# EAGLE design arduino uno board (EAGLE 9.4.2)
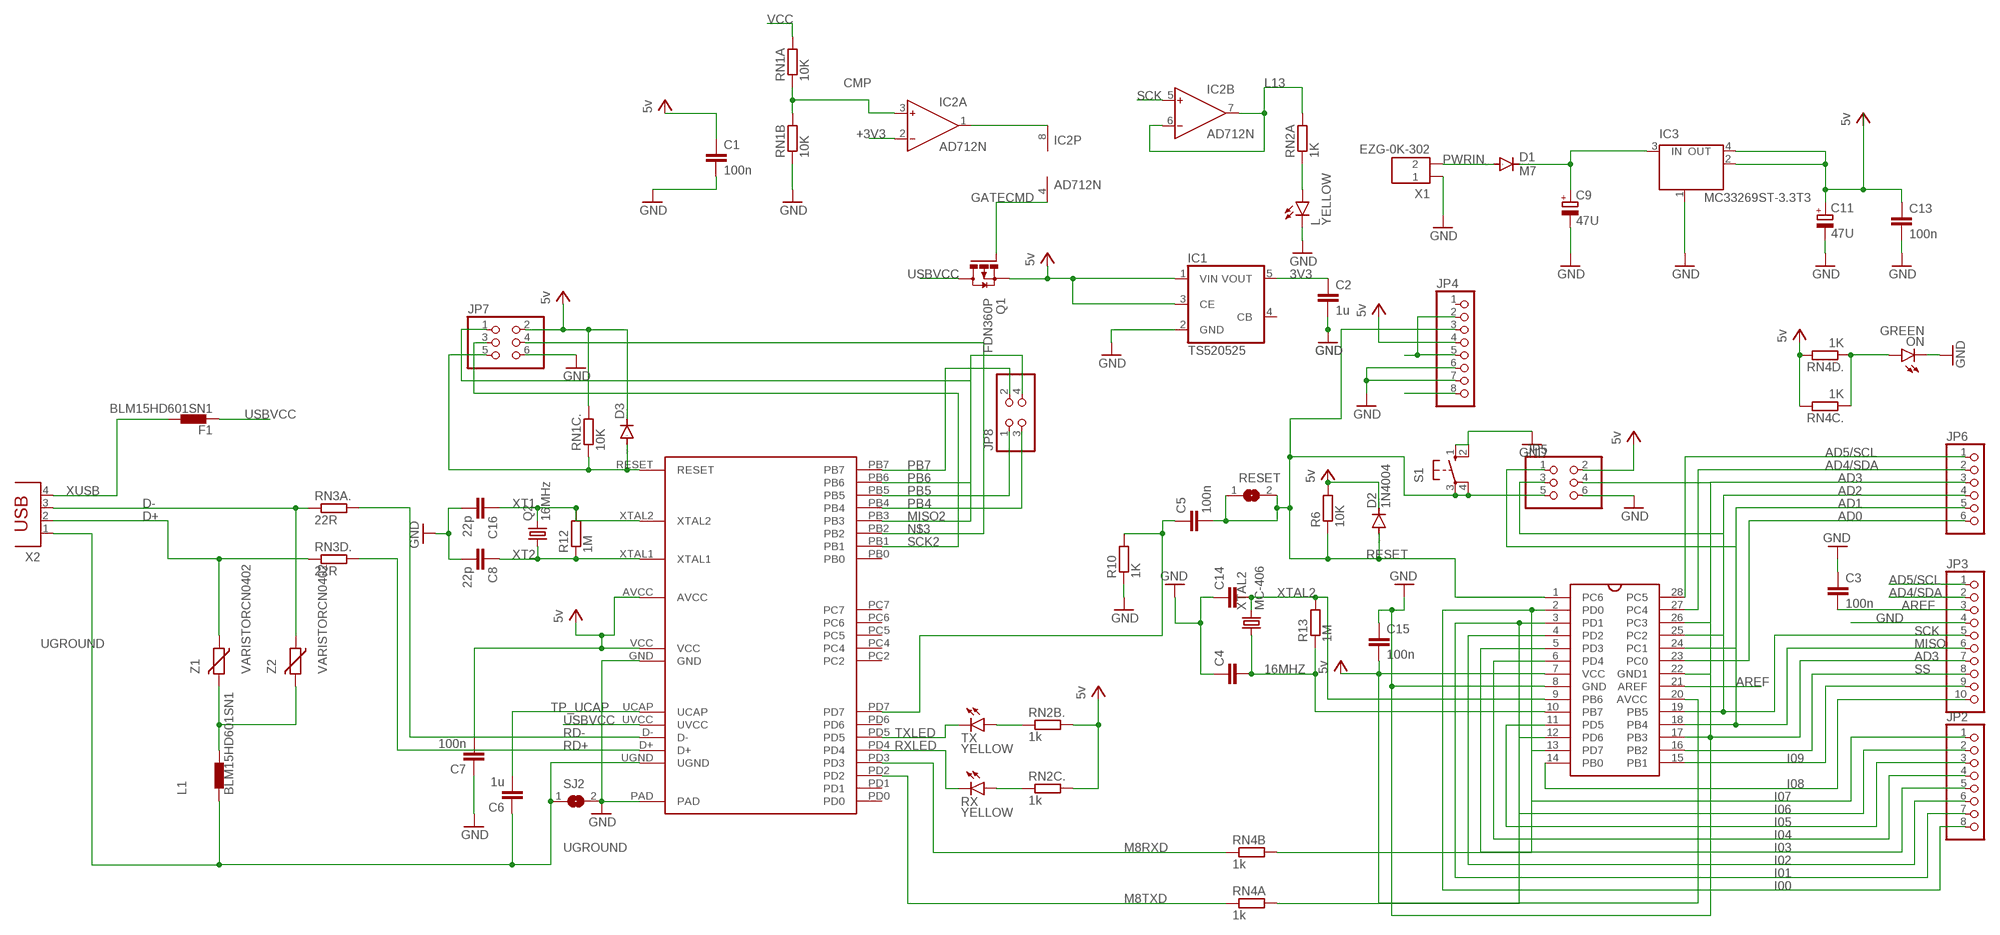
[diagram p0: schematic, sheet 1]

## Parts
C1  100n  C-EUC0603  [C0603]
C2  1u  C-EUC0603  [C0603]
C3  100n  C-EUC0603  [C0603]
C4  C-EUC0603  [C0603]
C5  100n  C-EUC0603  [C0603]
C6  1u  C-EUC0603  [C0603]
C7  100n  C-EUC0603  [C0603]
C8  22p  C-EUC0603  [C0603]
C9  47U  CPOL-EUR/2012-12W  [R/2012-12W]
C11  47U  CPOL-EUR/2012-12W  [R/2012-12W]
C13  100n  C-EUC0603  [C0603]
C14  C-EUC0603  [C0603]
C15  100n  C-EUC0603  [C0603]
C16  22p  C-EUC0603  [C0603]
D1  M7  DIODE-MICROMELF-R  [MICROMELF-R]
D2  1N4004  DIODE-MICROMELF-R  [MICROMELF-R]
D3  DIODE-MICROMELF-R  [MICROMELF-R]
F1  BLM15HD601SN1  [0402]
IC1  TS520525  [SOT25]
IC2  AD712N  [DIL08]
IC3  MC33269ST-3.3T3  [SOT223]
JP2  PINHD-1X8  [1X08]
JP3  PINHD-1X10  [1X10]
JP4  PINHD-1X8  [1X08]
JP5  PINHD-2X3  [2X03]
JP6  PINHD-1X6  [1X06]
JP7  PINHD-2X3  [2X03]
JP8  PINHD-2X2  [2X02]
L  YELLOW  LEDCHIPLED-0603-TTW  [CHIPLED-0603-TTW]
L1  BLM15HD601SN1  [0402]
ON  GREEN  LEDCHIPLED-0603-TTW  [CHIPLED-0603-TTW]
Q1  FDN360P  [SUPER-SOT3]
Q2  16MHz  CRYSTALCTS406  [CTS406]
R6  10K  R-EU_R0201  [R0201]
R10  1K  R-EU_R0201  [R0201]
R12  1M  R-EU_R0201  [R0201]
R13  1M  R-EU_R0201  [R0201]
RESET  SJ  [SJ]
RN1A  10K  R-EU_R0201  [R0201]
RN1B  10K  R-EU_R0201  [R0201]
RN1C.  10K  R-EU_R0201  [R0201]
RN2A  1K  R-EU_R0201  [R0201]
RN2B.  1k  R-EU_R0201  [R0201]
RN2C.  1k  R-EU_R0201  [R0201]
RN3A.  22R  R-EU_R0201  [R0201]
RN3D.  22R  R-EU_R0201  [R0201]
RN4A  1k  R-EU_R0201  [R0201]
RN4B  1k  R-EU_R0201  [R0201]
RN4C.  1K  R-EU_R0201  [R0201]
RN4D.  1K  R-EU_R0201  [R0201]
RX  YELLOW  LEDCHIPLED-0603-TTW  [CHIPLED-0603-TTW]
S1  10-XX  [B3F-10XX]
SJ2  SJ  [SJ]
TX  YELLOW  LEDCHIPLED-0603-TTW  [CHIPLED-0603-TTW]
U$1  ARDUINOUNO  [ARDUINOUNO]
U$2  ATMEGA16U2  [ATMEGA16U2]
X1  EZG-0K-302  [EZG-0B-0K-302]
X2  PN61729  [PN61729]
XTAL2  MC-406  [MC-406]
Z1  VARISTORCN0402  [CT/CN0402]
Z2  VARISTORCN0402  [CT/CN0402]

## Nets
3V3: C2.1 IC1.5(VOUT)
16MHZ: C4.2 R13.1 U$1.10(PB7) XTAL2.1
+3V3: IC2.2(A:IN-)
AD0: JP6.6 U$1.23(PC0)
AD1: JP6.5 U$1.24(PC1)
AD2: JP6.4 U$1.25(PC2)
AD3: JP3.7 JP5.4 JP6.3 U$1.17(PB3) U$1.26(PC3)
AD4/SDA: JP3.2 JP6.2 U$1.27(PC4)
AD5/SCL: JP3.1 JP6.1 U$1.28(PC5)
AREF: C3.2 JP3.3 U$1.21(AREF)
CMP: IC2.3(A:IN+) RN1A.1 RN1B.2
D+: RN3D..1 X2.2 Z1.1
D-: RN3A..1 X2.3 Z2.1
GATECMD: IC2.4(P:V-) Q1.1(G)
GND: C1.2 C2.2 C3.1 C4.1 C7.1 C8.2 C9.- C11.- C13.2 C14.1 C15.1 C16.2 IC1.2(GND) IC3.1(GND/ADJ) JP3.4 JP4.6 JP4.7 JP5.6 JP7.6 L.C@1(C) ON.C@1(C) R10.1 RN1B.1 S1.1(S) S1.2(S1) SJ2.2 U$1.8(GND) U$1.22(GND1) U$2.GND U$2.PAD X1.1
I00: JP2.8 RN4B.2 U$1.2(PD0)
I01: JP2.7 RN4A.2 U$1.3(PD1)
I02: JP2.6 U$1.4(PD2)
I03: JP2.5 U$1.5(PD3)
I04: JP2.4 U$1.6(PD4)
I05: JP2.3 U$1.11(PD5)
I06: JP2.2 U$1.12(PD6)
I07: JP2.1 U$1.13(PD7)
I08: JP3.10 U$1.14(PB0)
I09: JP3.9 U$1.15(PB1)
L13: IC2.6(B:IN-) IC2.7(B:OUT) RN2A.2
M8RXD: RN4B.1 U$2.PD3
M8TXD: RN4A.1 U$2.PD2
MISO: JP3.6 JP5.1 U$1.18(PB4)
MISO2: JP7.1 U$2.PB3
N$1: RN2B..1 TX.A@1(A)
N$2: RN2C..1 RX.A@1(A)
N$3: JP7.4 U$2.PB2
N$4: IC2.1(A:OUT) IC2.8(P:V+)
N$6: C9.+ D1.C IC3.3(IN)
N$8: L.A@1(A) RN2A.1
N$9: ON.A@1(A) RN4C..1 RN4D..1
N$37: C5.1 R10.2 U$2.PD7
N$38: JP4.8
N$40: JP4.2 JP4.5
N$56: D3.A JP7.5 RN1C..1 U$2.RESET
N$64: L1.2 Z1.2 Z2.2
PB4: JP8.3 U$2.PB4
PB5: JP8.1 U$2.PB5
PB6: JP8.4 U$2.PB6
PB7: JP8.2 U$2.PB7
PWRIN: D1.A X1.2
RD+: RN3D..2 U$2.D+
RD-: RN3A..2 U$2.D-
RESET: C5.2 D2.A JP4.3 JP5.5 R6.1 RESET.1 RESET.2 S1.3(P) S1.4(P1) U$1.1(PC6)
RXLED: RX.C@1(C) U$2.PD4
SCK: IC2.5(B:IN+) JP3.5 JP5.3 U$1.19(PB5)
SCK2: JP7.3 U$2.PB1
SS: JP3.8 U$1.16(PB2)
TP_UCAP: C6.2 U$2.UCAP
TXLED: TX.C@1(C) U$2.PD5
UGROUND: C6.1 L1.1 SJ2.1 U$2.UGND X2.1
USBVCC: F1.1 Q1.3(D) U$2.UVCC
VCC: C1.1 C7.2 C11.+ C13.1 C15.2 D2.C D3.C IC1.1(VIN) IC1.3(CE) IC3.2(OUT) IC3.4(OUT) JP4.4 JP5.2 JP7.2 Q1.2(S) R6.2 RN1A.2 RN1C..2 RN2B..2 RN2C..2 RN4C..2 RN4D..2 U$1.7(VCC) U$1.20(AVCC) U$2.AVCC U$2.VCC ; supply symbol labelled 5v
XT1: C16.1 Q2.3 R12.2 U$2.XTAL2
XT2: C8.1 Q2.1 R12.1 U$2.XTAL1
XTAL2: C14.2 R13.2 U$1.9(PB6) XTAL2.4
XUSB: F1.2 X2.4
Unconnected: IC1.4(CB) JP4.1 U$2.PB0 U$2.PC2 U$2.PC4 U$2.PC5 U$2.PC6 U$2.PC7 U$2.PD0 U$2.PD1 U$2.PD6

## Library data of the parts
C1-C8 C13-C16 = rcl:C-EU: CAPACITOR, European symbol; SPICEPREFIX: C
C9 C11 = rcl:CPOL-EU: POLARIZED CAPACITOR, European symbol; SPICEPREFIX: C
D1-D3 = diode:DIODE-: DIODE
F1 L1 = inductors:BLM15H: EMIFIL (R) Chip Ferrite Bead for GHz Noise Source: http://www.murata.com/ Ferrite Bead BLM15H.pdf
IC1 = v-reg:TS5205: 150mA Low Noise LDO Voltage Regulator with Enable TSC [Taiwan Semiconductor Company, Ltd] Source: http://www.taiwansemi.com .. 5205_0409c.pdf
IC2 = analog-devices:AD712: Dual Precision, Low Cost, High Speed BiFET Op Amp Source: http://www.analog.com/static/imported-files/data_sheets/AD712.pdf; MF: ALTERA CORPORATION; MPN: AD712JNZ; OC_FARNELL: 9604898; OC_NEWARK: 59K4554
IC3 = linear:MC33269ST*: Adjustable Output Low Dropout Voltage Regulator 800 mA Source: http://www.onsemi.com/pub/Collateral/MC33269-D.PDF
JP2 JP4 = pinhead:PINHD-1X8: PIN HEADER
JP3 = pinhead:PINHD-1X10: PIN HEADER
JP5 JP7 = pinhead:PINHD-2X3: PIN HEADER
JP6 = pinhead:PINHD-1X6: PIN HEADER
JP8 = pinhead:PINHD-2X2: PIN HEADER
L ON RX TX = led:LED: LED OSRAM: - CHIPLED LG R971, LG N971, LY N971, LG Q971, LY Q971, LO R971, LY R971 LH N974, LH R974 LS Q976, LO Q976, LY Q976 LO Q996 - Hyper CHIPLED LW Q18S LB Q993, LB Q99A, LB R99A - SideLED LS A670, LO A670, LY A670, LG A670, LP A670 LB A673, LV A673, LT A673, LW A673 LH A674 LY A675 LS A676, LA A676, LO A676, LY A676, LW A676 LS A679, LY A679, LG A679 - Hyper Micro SIDELED® LS Y876, LA Y876, LO Y876, LY Y876 LT Y87S - SmartLED LW L88C, LW L88S LB L89C, LB L89S, LG L890 LS L89K, LO L89K, LY L89K LS L896, LA L896, LO L896, LY L896 - TOPLED LS T670, LO T670, LY T670, LG T670, LP T670 LSG T670, LSP T670, LSY T670, LOP T670, LYG T670 LG T671, LOG T671, LSG T671 LB T673, LV T673, LT T673, LW T673 LH T674 LS T676, LA T676, LO T676, LY T676, LB T676, LH T676, LSB T676, LW T676 LB T67C, LV T67C, LT T67C, LS T67K, LO T67K, LY T67K, LW E67C LS E67B, LA E67B, LO E67B, LY E67B, LB E67C, LV E67C, LT E67C LW T67C LS T679, LY T679, LG T679 LS T770, LO T770, LY T770, LG T770, LP T770 LB T773, LV T773, LT T773, LW T773 LH T774 LS E675, LA E675, LY E675, LS T675 LS T776, LA T776, LO T776, LY T776, LB T776 LHGB T686 LT T68C, LB T68C - Hyper Mini TOPLED® LB M676 - Mini TOPLED Santana® LG M470 LS M47K, LO M47K, LY M47K Source: http://www.osram.convergy.de LUXEON: - LUMILED® LXK2-PW12-R00, LXK2-PW12-S00, LXK2-PW14-U00, LXK2-PW14-V00 LXK2-PM12-R00, LXK2-PM12-S00, LXK2-PM14-U00 LXK2-PE12-Q00, LXK2-PE12-R00, LXK2-PE12-S00, LXK2-PE14-T00, LXK2-PE14-U00 LXK2-PB12-K00, LXK2-PB12-L00, LXK2-PB12-M00, LXK2-PB14-N00, LXK2-PB14-P00, LXK2-PB14-Q00 LXK2-PR12-L00, LXK2-PR12-M00, LXK2-PR14-Q00, LXK2-PR14-R00 LXK2-PD12-Q00, LXK2-PD12-R00, LXK2-PD12-S00 LXK2-PH12-R00, LXK2-PH12-S00 LXK2-PL12-P00, LXK2-PL12-Q00, LXK2-PL12-R00 Source: www.luxeon.com KINGBRIGHT: KA-3528ASYC Source: www.kingbright.com
Q1 = transistor-power:FDN360P: Single P-Channel, PowerTrench (R) MOSFET Source: http://www.fairchildsemi.com/ds/FD/FDN360P.pdf
Q2 = crystal:CRYSTAL: CRYSTAL; OC_FARNELL: unknown; OC_NEWARK: unknown
R6 R10 R12 R13 RN1A RN1B RN1C. RN2A RN2B. RN2C. RN3A. RN3D. RN4A RN4B RN4C. RN4D. = rcl:R-EU_: RESISTOR, European symbol; SPICEPREFIX: R
RESET SJ2 = jumper:SJ: SMD solder JUMPER
S1 = switch-omron:10-XX: OMRON SWITCH; MPN: B3F-1000; OC_FARNELL: 176432; OC_NEWARK: 36M3542
U$1 = arduino uno:ARDUINOUNO
U$2 = arduino uno:ATMEGA16U2
X1 = con-lemo:EZG-?-302: LEMO Connector Source: http://www.lemo.com/pdfs/catalog/ROW/German/unipole_multipole.pdf; OC_FARNELL: unknown; OC_NEWARK: unknown
X2 = con-berg:PN61729: BERG USB connector; OC_FARNELL: unknown; OC_NEWARK: unknown
XTAL2 = crystal:MC-406: kHz RANGE CRYSTAL UNIT SMD Source: MC-306_405_406_E07X.PDF Homepage <http://www.epsontoyocom.co.jp>; MF: BANNER ENGINEERING CORPORATION; MPN: MQDMC-406; OC_FARNELL: 1216226; OC_NEWARK: 21H2317
Z1 Z2 = varistor:VARISTOR: VARISTOR

## Board
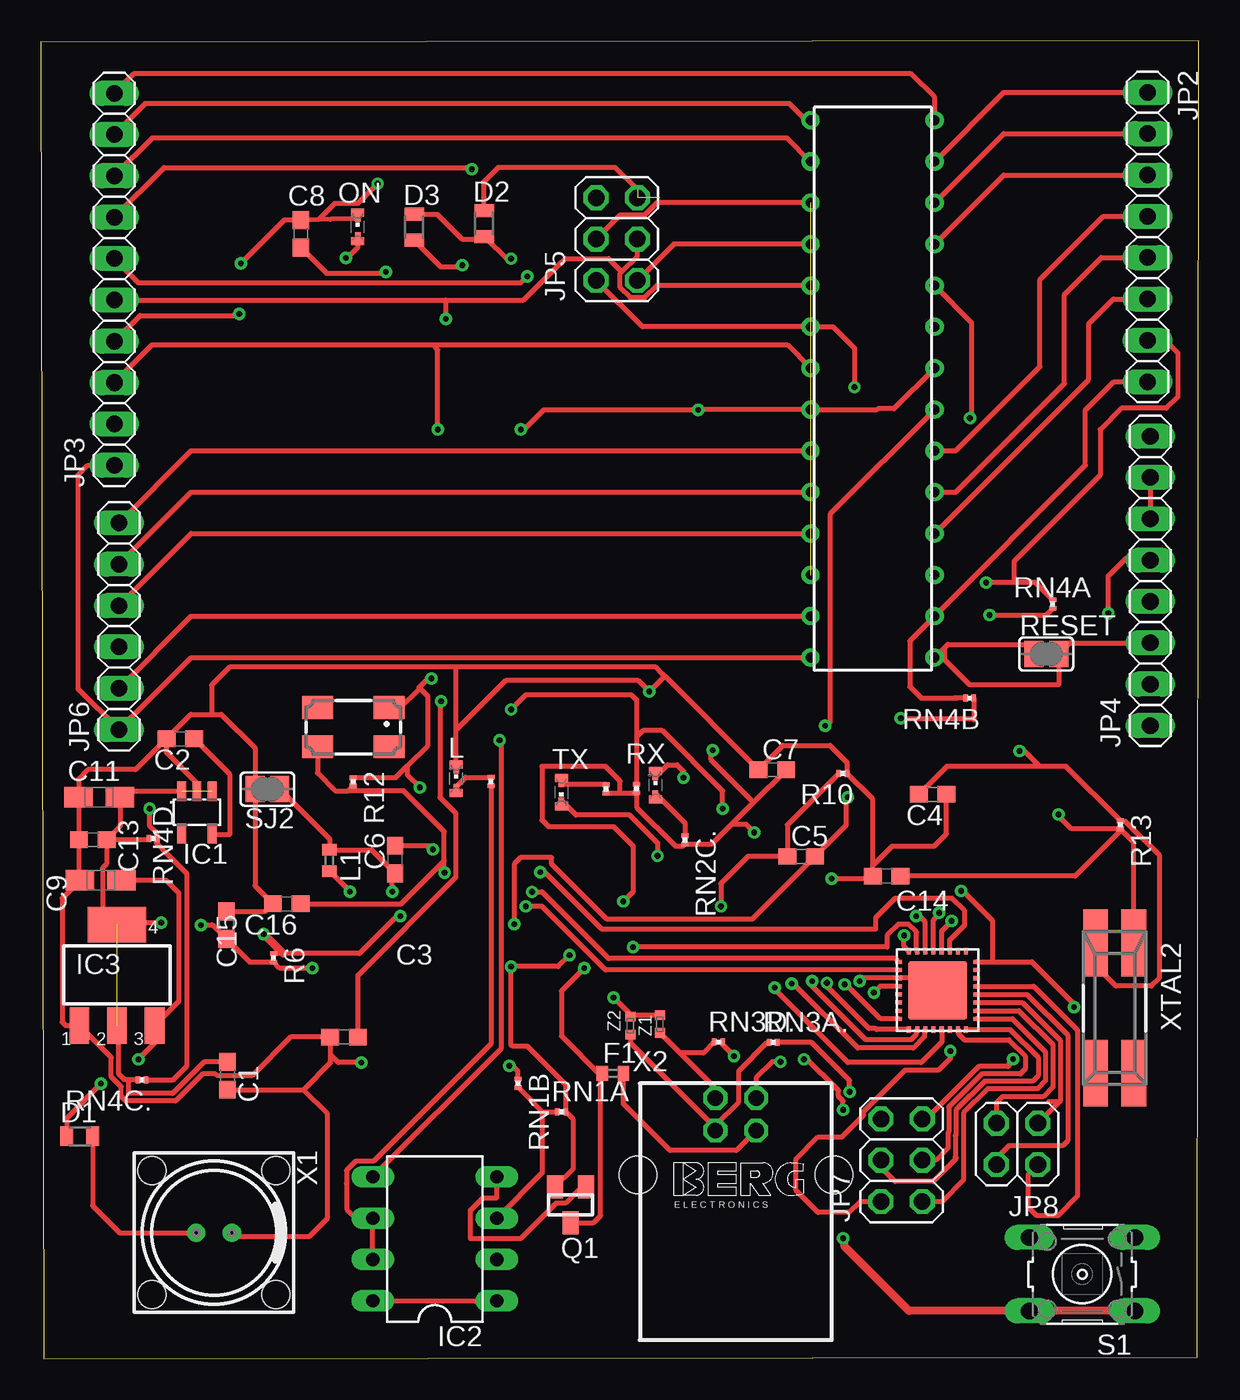
[diagram p1: board, top side]
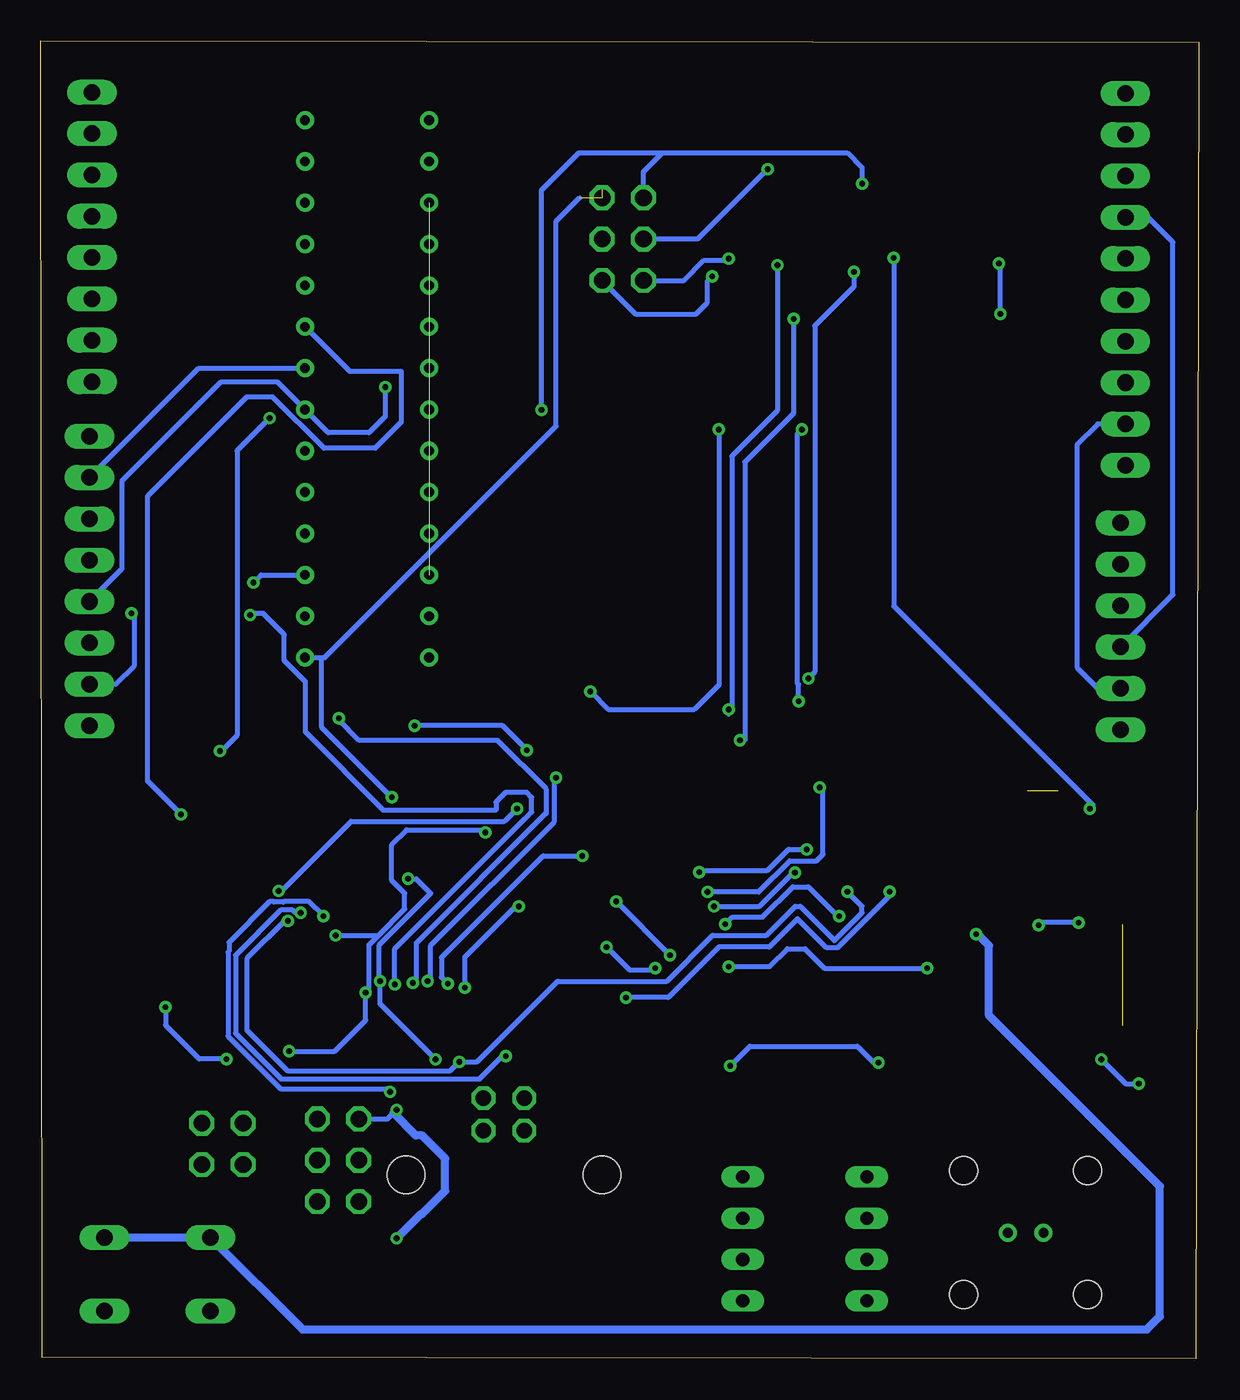
[diagram p2: board, bottom side, seen from below]

Size 71.17 x 80.99 mm. Coordinates in mm from the lower left corner, seen from the top.
Outline: 0.2,0 71.07,0.1 71.17,80.99 0,80.89 0.2,0
Copper layers (1*16): Top 0.035mm / dielectric 1.5mm / Bottom 0.035mm
Design rules "default": minimum track width 6mil, minimum drill 0.35mm, track to track 6mil, track to pad 6mil, pad to pad 6mil, via to via 6mil, smd to smd 6mil, copper to edge 40mil, drill to drill 6mil, minimum pad ring 10mil, minimum via ring 8mil, stop-mask expansion 4mil, vias tented up to drill 0mil, thermal gap 10mil

### Footprints (pad centres in the part's own frame; a part is rotated, then mirrored left to right if it is on the bottom)
C0603 = smd 1.1 x 1: 1 -0.85,0; 2 0.85,0
R/2012-12W = smd 1.75 x 1.26: + 1.275,0; - -1.275,0
MICROMELF-R = smd 0.8 x 1.2: A 0.8,0; C -0.8,0
0402 = smd 0.7 x 0.9: 1 -0.65,0; 2 0.65,0
SOT25 = smd 0.55 x 1.2: 1 -0.95,-1.3; 2 0,-1.3; 3 0.95,-1.3; 4 0.95,1.3; 5 -0.95,1.3
DIL08 = drill 0.813 long: 1 -3.81,-3.81; 2 -1.27,-3.81; 3 1.27,-3.81; 4 3.81,-3.81; 5 3.81,3.81; 6 1.27,3.81; 7 -1.27,3.81; 8 -3.81,3.81
SOT223 = smd 1.219 x 2.235: 1 -2.311,-3.099; 2 0,-3.099; 3 2.311,-3.099 | smd 3.6 x 2.2: 4 0,3.099
1X08 = drill 1.016 long: 1 -8.89,0; 2 -6.35,0; 3 -3.81,0; 4 -1.27,0; 5 1.27,0; 6 3.81,0; 7 6.35,0; 8 8.89,0
1X10 = drill 1.016 long: 1 -11.43,0; 2 -8.89,0; 3 -6.35,0; 4 -3.81,0; 5 -1.27,0; 6 1.27,0; 7 3.81,0; 8 6.35,0; 9 8.89,0; 10 11.43,0
2X03 = drill 1.016 octagon: 1 -2.54,-1.27; 2 -2.54,1.27; 3 0,-1.27; 4 0,1.27; 5 2.54,-1.27; 6 2.54,1.27
1X06 = drill 1.016 long: 1 -6.35,0; 2 -3.81,0; 3 -1.27,0; 4 1.27,0; 5 3.81,0; 6 6.35,0
2X02 = drill 1.016 octagon: 1 -1.27,-1.27; 2 -1.27,1.27; 3 1.27,-1.27; 4 1.27,1.27
CHIPLED-0603-TTW = smd 0.8 x 0.5: A 0,-0.875; C 0,0.875 | smd 0.35 x 0.35: A@1 0,-0.5; C@1 0,0.5
SUPER-SOT3 = smd 1 x 1.4: 1 -0.95,-1.1; 2 0.95,-1.1; 3 0,1.1
CTS406 = smd 1.9 x 1.4: 1 -2.2,-1.2; 2 2.2,-1.2; 3 2.2,1.2; 4 -2.2,1.2
R0201 = smd 0.28 x 0.43: 1 -0.255,0; 2 0.255,0
SJ = smd 1.168 x 1.6: 1 -0.762,0; 2 0.762,0
B3F-10XX = drill 1.016 long: 1 -3.251,2.261; 2 3.251,2.261; 3 -3.251,-2.261; 4 3.251,-2.261
ARDUINOUNO = drill 0.6: 1 -3.81,16.51; 2 -3.81,13.97; 3 -3.81,11.43; 4 -3.81,8.89; 5 -3.81,6.35; 6 -3.81,3.81; 7 -3.81,1.27; 8 -3.81,-1.27; 9 -3.81,-3.81; 10 -3.81,-6.35; 11 -3.81,-8.89; 12 -3.81,-11.43; 13 -3.81,-13.97; 14 -3.81,-16.51; 15 3.81,-16.51; 16 3.81,-13.97; 17 3.81,-11.43; 18 3.81,-8.89; 19 3.81,-6.35; 20 3.81,-3.81; 21 3.81,-1.27; 22 3.81,1.27; 23 3.81,3.81; 24 3.81,6.35; 25 3.81,8.89; 26 3.81,11.43; 27 3.81,13.97; 28 3.81,16.51
ATMEGA16U2 = smd 0.25 x 0.4: AVCC -1.75,2.4; D+ -0.25,2.4; D- -0.75,2.4; PB0 0.75,-2.4; PB1 1.25,-2.4; PB2 1.75,-2.4; PC4 1.25,2.4; PC5 1.75,2.4; PD3 -1.75,-2.4; PD4 -1.25,-2.4; PD5 -0.75,-2.4; PD6 -0.25,-2.4; PD7 0.25,-2.4; UCAP 0.75,2.4; UGND 0.25,2.4; UVCC -1.25,2.4 | smd 0.4 x 0.25: GND -2.4,0.75; PB3 2.4,-1.75; PB4 2.4,-1.25; PB5 2.4,-0.75; PB6 2.4,-0.25; PB7 2.4,0.25; PC2 -2.4,-0.25; PC6 2.4,1.25; PC7 2.4,0.75; PD0 -2.4,-0.75; PD1 -2.4,-1.25; PD2 -2.4,-1.75; RESET 2.4,1.75; VCC -2.4,0.25; XTAL1 -2.4,1.75; XTAL2 -2.4,1.25 | smd 3.6 x 3.6: PAD 0,0
EZG-0B-0K-302 = drill 0.6 pad 1: 1 0,1.1; 2 0,-1.1 | hole 1.7: -3.81,3.81; 3.81,3.81; 3.81,-3.81; -3.81,-3.81
PN61729 = drill 0.95 octagon: 1 1.25,4.71; 2 -1.25,4.71; 3 -1.25,2.71; 4 1.25,2.71 | hole 2.3: -6.02,0; 6.02,0
MC-406 = smd 4.1 x 1.52: 1 -4,-1.175; 2 4,-1.175; 3 4,1.175; 4 -4,1.175
CT/CN0402 = smd 0.6 x 0.6: 1 -0.55,0; 2 0.55,0

### Placement (x,y rotation side)
C1  11.48,17.39 270 top
C2  8.58,38.1 180 top
C3  18.64,19.77 0 top
C4  54.81,34.69 180 top
C5  46.73,30.87 0 top
C6  21.78,30.68 90 top
C7  44.96,36.19 0 top
C8  15.99,69.12 90 top
C9  3.7,29.4 0 top
C11  3.6,34.5 0 top
C13  3.2,31.9 180 top
C14  51.98,29.66 0 top
C15  11.42,26.64 270 top
C16  15.12,27.96 180 top
D1  2.39,13.68 0 top
D2  27.25,69.76 90 top
D3  22.95,69.53 270 top
F1  35.16,17.54 0 top
IC1  9.6,33.58 180 top
IC2  24.22,7.37 90 top
IC3  4.69,23.58 0 top
JP2  68.02,68.93 270 top
JP3  4.52,66.33 90 top
JP4  68.18,47.8 90 top
JP5  35.4,68.8 90 top
JP6  4.81,45.01 90 top
JP7  52.9,12.2 90 top
JP8  60,13.2 180 top
L  25.53,35.65 0 top
L1  17.74,30.62 270 top
ON  19.48,69.55 0 top
Q1  32.56,9.46 180 top
Q2  19.21,38.81 180 top
R6  14.3,24.64 270 top
R10  49.29,35.97 180 top
R12  19.2,35.46 270 top
R13  66.33,32.82 270 top
RESET  61.79,43.3 0 top
RN1A  32.01,15.18 0 top
RN1B  29.33,16.92 270 top
RN1C.  36.62,35.05 270 top
RN2A  27.66,35.47 270 top
RN2B.  34.73,35.01 270 top
RN2C.  39.58,31.88 270 top
RN3A.  45.01,19.44 0 top
RN3D.  41.64,19.46 0 top
RN4A  62.18,46.38 90 top
RN4B  57.08,40.59 180 top
RN4C.  6.22,17.15 180 top
RN4D.  6.92,31.97 180 top
RX  37.77,35.25 0 top
S1  64,5.2 180 top
SJ2  13.93,35 180 top
TX  31.99,34.81 180 top
U$1  51.12,59.6 180 top
U$2  55.11,22.64 0 top
X1  10.65,7.75 270 top
X2  42.71,11.31 0 top
XTAL2  65.99,21.56 270 top
Z1  38.05,20.57 90 top
Z2  36.24,20.47 90 top

### Tracks (layer width: path | path; a pad name or v marks a point on that pad's centre or on a via)
3V3
  Top 0.3: C2.1 11.6,35.93 11.6,32.2 10.63,32.2 IC1.5
  Top 0.5: 9.5,38.17 C2.1
16MHZ  (via drill 0.35)
  Top 0.3: XTAL2.1 64.81,24.16 66.07,22.91 68.25,22.91 68.73,23.39 68.73,30.95 66.66,33.02 66.39,33.02 R13.1 63.01,36.4 61.4,36.4 | C4.2 55.67,36.4 61.4,36.4 | U$1.10 57.2,63.68 57.2,57.8 v57.1,57.8 | v60.15,37.35 60.45,37.35 61.4,36.4
  Bottom 0.3: v57.1,57.8 59.1,55.8 59.1,38.3 60.1,37.3 v60.15,37.35
AD0
  Top 0.3: JP6.6 9.24,55.79 U$1.23
AD1
  Top 0.3: JP6.5 9.24,53.25 U$1.24
AD2
  Top 0.3: JP6.4 9.24,50.71 U$1.25
AD3  (via drill 0.35)  (1 unrouted)
  Top 0.3: U$1.17 37.87,71.03 37.11,70.28 35.61,70.28 JP5.4 | v26.5,73.1 26.5,73.2 7.58,73.2 JP3.7
  Bottom 0.3: v26.5,73.1 30.8,68.8 JP5.4 | JP6.3 1.6,46.95 1.6,68.6 3.14,70.14 JP3.7
AD4/SDA
  Top 0.3: JP6.2 9.24,45.63 U$1.27
  Bottom 0.3: JP3.2 6.22,57.44 7.5,56.16 7.5,42.49 6.21,41.2 JP6.2
AD5/SCL
  Top 0.3: U$1.28 9.24,43.09 JP6.1 2.3,41.17 2.3,54.3 2.9,54.9 JP3.1
AREF  (via drill 0.35)
  Top 0.3: JP3.3 6.84,62.3 24.1,62.3 | U$1.21 45.88,62.3 24.1,62.3 | C3.2 19.49,23.57 25.5,29.58 25.5,33.5 25.51,33.51 24.53,34.5 24.53,40.33 v24.6,40.4 | v24.4,57.1 24.4,62 24.1,62.3
  Bottom 0.3: v24.6,40.4 24.6,41.44 24.68,41.52 24.68,56.82 v24.4,57.1
CMP
  Top 0.3: RN1B.2 30.81,15.18 | 30.81,15.18 RN1A.1 | 30.81,15.18 30.81,11.43 IC2.3
D+
  Top 0.3: Z1.1 39.29,18.79 | 39.29,18.79 41.46,16.61 X2.2 41.46,16.14 | RN3D..1 40.71,18.79 39.29,18.79
D-
  Top 0.3: Z2.1 36.24,19.42 41.46,14.2 X2.3 41.46,14.36 42.89,15.79 42.89,17.69 44.64,19.44 RN3A..1
GATECMD
  Top 0.3: Q1.1 33.24,10.56 32.23,9.56 31.67,9.56 29.49,7.38 26.41,7.38 26.41,9.14 27.17,9.9 28.03,9.9 IC2.4
GND  (via drill 0.35)
  Top 0.3: U$2.PAD 54.36,23.39 U$2.GND 50.51,23.39 v50.32,23.2 | JP4.7 JP4.6 | 15.99,70.19 C8.2 | ON.C@1 17.81,70.01 17.07,70 | 17.07,70 C8.2 | v20.7,72.2 19.48,70.98 18.05,70.98 17.07,70 | JP3.4 6.1,64.1 12.1,64.1 v12.2,64.2 | C8.2 14.97,69.97 v12.3,67.3 | U$1.8 52.43,58.37 51.45,58.37 51.41,58.33 U$1.22 40.4,58.33 v40.4,58.3 30.9,58.3 29.7,57.1 v29.5,57.1 | C2.2 5.83,36.2 2.9,36.2 2.33,35.62 C11.- 2.33,31.93 C13.2 2.35,29.48 C9.- 1.31,28.29 1.31,20.7 1.53,20.48 IC3.1 4.35,18.51 4.35,17.31 4.95,16.71 4.95,16.11 5.21,15.85 8.29,15.85 9.94,17.5 10.74,17.5 10.85,17.39 12.99,17.39 15.37,19.77 C3.1 17.79,18.7 | IC1.2 9.6,35.38 7.73,37.25 C2.2 | C2.2 9.23,39.6 10.5,39.6 | 10.5,39.6 11.1,39.6 13.17,37.53 SJ2.2 13.17,29.06 C16.2 13.8,27.49 C15.1 | C1.2 16.16,16.54 | 16.16,16.54 17.6,15.1 17.6,8.6 16.5,7.5 12,7.5 X1.1 | 17.79,18.7 17.79,18.17 16.16,16.54 | 38.25,42.05 37.8,42.5 25.5,42.5 | 25.5,42.5 11.6,42.5 10.5,41.4 10.5,39.6 | 25.53,38.63 25.53,42.47 25.5,42.5 | 51.13,30.3 C14.1 50.97,29.5 v48.6,29.5 | 51.13,30.3 52.33,31.5 54.9,31.5 55.66,32.26 C4.1 | 51.13,30.3 51.13,34.38 R10.1 49.55,36.66 48.5,37.7 45.62,37.7 C7.1 38.35,41.95 v37.4,41 36.7,41.7 28.6,41.7 25.53,38.63 | L.C@1 25.53,38.63 | RN1B.1 29.33,17.67 28.9,18.1 v28.8,18 | v19.7,18.2 18.29,18.2 17.79,18.7 | v49.3,15.3 49.3,15.84 49.02,16.12 49.02,16.48 47,18.5 v46.9,18.4
  Top 0.5: C9.- 2.62,29.4 | S1.1 S1.2 53.36,2.94 49.4,6.9 49.4,7.4 v49.3,7.4
  Bottom 0.3: JP5.6 34.13,72.94 32.97,74.1 | 32.97,74.1 21.6,74.1 20.7,73.2 v20.7,72.2 | v12.2,64.2 12.2,67.2 v12.3,67.3 | v40.4,58.3 40.4,71.8 38.1,74.1 32.97,74.1 | JP4.7 61.46,60.87 U$1.8 | v29.5,57.1 29.5,41.4 31,39.9 36.3,39.9 v37.4,41 | v48.6,29.5 48.1,29.5 47.2,28.6 50.4,25.4 50.4,23.2 v50.32,23.2 50.32,21.82 v46.9,18.4 | v28.8,18 27.6,19.2 21,19.2 20,18.2 v19.7,18.2 | JP7.6 49.86,14.74 49.5,15.1 v49.3,15.3
  Bottom 0.5: v49.3,7.4 47.81,8.89 47.73,8.89 46.31,10.31 46.31,12.31 47.73,13.73 48.13,13.73 49.5,15.1
I00
  Top 0.3: JP2.8 65.94,60.04 64.2,58.3 64.2,54.9 U$1.2 53.4,44.1 53.4,41.3 54.1,40.6 56.1,40.6 | 56.1,40.6 56.3,40.6 | RN4B.2 56.11,40.59 56.1,40.6
I01  (via drill 0.35)
  Top 0.3: RN4A.2 61.12,47.7 59.8,47.7 | 59.8,47.7 v58.1,47.7 | JP2.7 69.12,62.58 69.88,61.82 69.88,59.1 69.18,58.4 66.4,58.4 65.1,57.1 65.1,54.3 59.8,49 59.8,47.7
  Bottom 0.3: v58.1,47.7 57.63,48.17 U$1.3
I02
  Top 0.3: U$1.4 64.4,60.18 64.4,63.6 65.92,65.12 JP2.6
I03
  Top 0.3: U$1.5 56.23,53.25 62.9,59.92 62.9,65.4 65.16,67.66 JP2.5
I04
  Top 0.3: U$1.6 56.23,55.79 61.4,60.96 61.4,66.3 65.3,70.2 JP2.4
I05
  Top 0.3: U$1.11 59.18,72.74 JP2.3
I06
  Top 0.3: U$1.12 59.18,75.28 JP2.2
I07
  Top 0.3: U$1.13 59.18,77.82 JP2.1
I08
  Top 0.3: U$1.14 54.93,77.51 53.48,78.96 5.72,78.96 JP3.10
I09
  Top 0.3: U$1.15 47.03,76.11 46.02,77.12 6.42,77.12 JP3.9
L13
  Top 0.3: IC2.7 20.41,8.6 | 20.41,8.6 IC2.6 | RN2A.2 27.66,19.36 20.44,12.14 19.35,12.14 18.79,11.58 18.79,10.78 18.8,10.77 18.8,9.2 19.4,8.6 20.41,8.6
M8RXD  (via drill 0.35)
  Top 0.3: U$2.PD3 51.36,20.24 51.3,20.3 50.9,20.3 48.4,22.8 48.4,23.1 v48.31,23.1 | v52.85,39.35 57.25,39.35 57.34,39.27 RN4B.1
  Bottom 0.3: v48.31,23.1 48.08,23.33 48.08,25.56 40.14,33.5 40.1,33.5 40.1,35 43.1,38 51.6,38 52.9,39.3 v52.85,39.35
M8TXD  (via drill 0.35)
  Top 0.3: RN4A.1 62.2,46.1 61.8,45.7 v58.3,45.7 | U$2.PD2 51.61,20.89 49.4,23.1 v49.4,23.01 v49.41,23
  Bottom 0.3: v49.41,23 49.41,25.19 41.4,33.2 41.3,33.3 41,33.6 41,34.5 41.3,34.8 42.6,34.8 43.2,34.2 43.2,33.7 50.1,33.7 54.9,38.5 54.9,41.6 56.2,42.9 56.2,44.5 57.5,45.8 58.3,45.8 v58.3,45.7
MISO  (via drill 0.35)
  Top 0.3: U$1.18 38.9,68.49 JP5.1 | v29.9,66.5 29.5,66.1 6.02,66.1 JP3.6
  Bottom 0.3: JP5.1 34.61,64.2 30.9,64.2 30.2,64.9 30.2,66.2 v29.9,66.5
MISO2
  Top 0.3: U$2.PB3 59.71,20.89 61.74,18.86 61.74,17.1 61.24,16.6 58.2,16.6 56.7,15.1 56.7,11 55.36,9.66 JP7.1
N$1
  Top 0.3: TX.A@1 34.69,35.31 RN2B..1
N$2
  Top 0.3: RX.A@1 39.58,32.94 RN2C..1
N$3
  Top 0.3: U$2.PB2 59.56,20.24 61.29,18.51 61.29,17.39 60.95,17.05 58.01,17.05 56.25,15.29 56.25,13.75 56.2,13.7 56.2,12.4 56.25,12.35 56.25,12.3 54.85,10.9 52.5,10.9 51.63,11.77 JP7.4
N$4
  Top 0.3: IC2.8 IC2.1
N$6  (via drill 0.35)
  Top 0.3: C9.+ 7.7,29.4 8.5,28.6 8.5,21.98 IC3.3 7,19.4 v6,18.4 | v3.7,16.9 1.59,14.79 D1.C
  Bottom 0.3: v6,18.4 4.5,16.9 v3.7,16.9
N$8
  Top 0.3: L.A@1 26.11,35.73 RN2A.1
N$9  (via drill 0.35)
  Top 0.3: RN4C..1 8.15,17.15 9,18 9,29.8 7.8,31 7.17,31.62 | 7.17,31.62 RN4D..1 | ON.A@1 19.48,68.28 18.8,67.6 v18.75,67.65 | v6.7,33.8 6.7,32.72 7.12,32.3 7.12,31.68 7.17,31.62
  Bottom 0.3: v18.75,67.65 18.75,46.25 6.5,34 v6.7,33.8
N$37  (via drill 0.35)
  Top 0.3: R10.2 45.88,32.81 C5.1 43.47,30.87 41.8,29.2 v41.8,27.8 | U$2.PD7 55.36,19.46 54.1,18.2 49.6,18.2 45.2,22.6 45.2,22.8 v45.1,22.8
  Top 0.5: 45.64,30.63 C5.1
  Bottom 0.3: v45.1,22.8 45.1,24.7 42,27.8 v41.8,27.8
N$40  (via drill 0.35)
  Top 0.3: v65.6,45.8 65.6,48.1 66.7,49.2 68.05,49.2 JP4.5
  Bottom 0.3: JP4.2 66.55,41.45 65.4,42.6 65.4,45.6 v65.6,45.8
N$56  (via drill 0.35)
  Top 0.3: D3.A 24.58,67.1 25.9,67.1 v25.9,67.2 | v28.9,39.9 29.8,40.8 36.3,40.8 36.62,40.48 36.62,38.2 | 36.62,38.2 36.62,37.4 RN1C..1 | U$2.RESET 58.5,24.39 | 58.5,24.39 60.91,24.39 63.6,21.7 v63.5,21.6 | v59.75,18.42 59.5,18.17 59.5,18 59.46,17.96 57.64,17.96 54.42,14.74 JP7.5 | 58.5,24.39 58.5,26.9 56.6,28.8 v56.55,28.75 | v41.9,33.8 41.9,34.9 38.2,38.6 37.02,38.6 36.62,38.2
  Bottom 0.3: v25.9,67.2 25.9,58.26 28.7,55.46 28.7,40.1 v28.9,39.9 28.9,39.6 | v63.5,21.6 63.5,20.5 61.42,18.42 v59.75,18.42 | v56.55,28.75 56.37,28.75 52.1,33.02 42.68,33.02 v41.9,33.8
N$64  (via drill 0.35)
  Top 0.3: Z1.2 36.34,21.12 Z2.2 36.24,21.16 v35.2,22.2 | L1.2 v19,28.71 v19,28.7
  Bottom 0.3: v19,28.7 19,28.46 22.21,25.25 22.89,25.25 24.67,27.03 26.4,25.3 29.5,25.3 32.6,22.2 v35.2,22.2
PB4
  Top 0.3: U$2.PB4 60.11,21.39 62.2,19.3 62.2,16.7 61.6,16.1 59.1,16.1 58.73,15.73 JP8.3
PB5
  Top 0.3: U$2.PB5 60.31,21.89 62.65,19.55 62.65,15.85 62.6,15.8 | 62.6,15.8 JP8.1 | 62.6,15.8 61.94,15.8
PB6
  Top 0.3: U$2.PB6 60.61,22.39 63.1,19.9 63.1,13.4 62.8,13.1 59.5,13.1 58.73,12.33 JP8.4
PB7
  Top 0.3: U$2.PB7 61.01,22.89 63.7,20.2 63.7,10 62.5,8.8 61.2,8.8 60.7,9.3 60.7,11.36 JP8.2
PWRIN
  Top 0.3: D1.A 3.19,9.41 4.85,7.75 X1.2
RD+  (via drill 0.35)
  Top 0.3: U$2.D+ 54.86,26.96 55.2,27.3 v55.2,27.4 | v42.6,18.6 41.9,19.3 RN3D..2
  Bottom 0.3: v55.2,27.4 55.52,27.4 55.7,27.58 56.42,27.58 59.2,24.8 59.2,20 56.4,17.2 44.2,17.2 42.8,18.6 v42.6,18.6
RD-  (via drill 0.35)
  Top 0.3: U$2.D- 54.36,26.84 53.9,27.3 v53.8,27.2 | v49.7,16.4 49.7,17.1 47.36,19.44 RN3A..2
  Bottom 0.3: v53.8,27.2 54.7,28.1 56.24,28.1 56.27,28.07 56.83,28.07 56.86,28.1 57.1,28.1 59.6,25.6 59.6,25.04 59.65,24.99 59.65,19.81 56.44,16.6 49.9,16.6 v49.7,16.4
RESET  (via drill 0.35)  (2 unrouted)
  Top 0.3: JP4.3 63.24,43.99 RESET.2 62.55,41.41 57.09,41.41 55.52,42.98 55.52,43.68 | U$1.1 55.52,43.68 | 55.52,43.68 55.74,43.9 60.8,43.9 61.03,43.67 RESET.1 | 36.67,71.83 35.3,73.2 28.1,73.2 27.2,72.3 27.2,70.61 D2.A | v49.6,34.5 49.5,34.5 49.5,32.79 C5.2 43.71,27 34.8,27 31.4,30.4 31.4,30.8 29.5,30.8 29.1,30.4 v29.1,26.7 | v22.1,27.2 21.9,27.2 19.59,24.89 14.9,24.89 R6.1
  Top 0.5: 14.9,24.89 v13.7,26.09 v13.7,26.1
  Bottom 0.3: U$1.1 53.9,43.09 | 53.9,43.09 53.72,43.09 39.5,57.31 39.5,69.9 38.06,71.34 | v49.6,34.5 53.9,38.8 53.9,43.09 | v29.1,26.7 28.65,27.15 26.81,27.15 24.96,29 24,29 22.3,27.3 22.1,27.3 v22.1,27.2
  Bottom 0.5: S1.3 S1.4 55.09,1.8 3.2,1.8 2.4,2.6 2.4,10.6 12.9,21.1 12.9,25.4 13.6,26.1 v13.7,26.1
RXLED  (via drill 0.35)
  Top 0.3: U$2.PD4 53.79,20.17 53.79,19.91 53.47,19.6 50.7,19.6 47.4,22.9 v47.4,23.21 47.4,23.3 | 37.77,35.97 RX.C@1 38.52,36.5 39.1,36.5 39.5,36.1 v39.5,35.7
  Bottom 0.3: v47.4,23.21 47.2,23.41 47.2,25.4 39.6,33 39.6,35.7 v39.5,35.7
SCK  (via drill 0.35)
  Top 0.3: 35.7,66.8 35.61,66.7 35.61,65.82 36.23,65.2 37.11,65.2 37.87,65.95 U$1.19 | 35.7,66.8 36.67,67.77 JP5.3 | JP3.5 24.9,65.06 | 24.9,65.06 29.66,65.06 31.94,67.34 31.97,67.34 32.23,67.6 34.9,67.6 35.7,66.8 | v28.2,38 28.2,37.85 28.28,37.78 28.28,19.05 IC2.5 | v24.9,63.9 24.9,65.06
  Bottom 0.3: v28.2,38 27.9,38 27.9,55.1 24.9,58.1 v24.9,63.9
SCK2
  Top 0.3: U$2.PB1 56.41,20.19 56.41,19.94 56.75,19.6 59.5,19.6 60.5,18.6 60.5,17.8 60.21,17.5 57.83,17.5 55.8,15.47 55.8,13.94 55.75,13.89 55.75,12.95 55,12.2 JP7.3
SS
  Top 0.3: U$1.16 45.88,75 6.84,75 JP3.8
TP_UCAP  (via drill 0.35)
  Top 0.3: C6.2 23.87,31.53 v24.1,31.3 | v30.7,29.91 30.95,29.91 34.46,26.4 51.3,26.4 51.3,27.1 52.5,28.3 56,28.3 56.76,27.54 56.76,26.64 55.86,25.74 U$2.UCAP
  Bottom 0.3: v30.7,29.91 30.6,30.01 26.5,30.01 25.21,31.3 v24.1,31.3
TXLED  (via drill 0.35)
  Top 0.3: U$2.PD5 54.31,20.19 54.31,19.8 53.61,19.1 50.2,19.1 46.2,23.1 v46.15,23.05 | TX.C@1 32.89,33.41 36.19,33.41 37.9,31.7 v37.9,30.9
  Bottom 0.3: v46.15,23.05 46.55,23.45 46.55,24.65 40.3,30.9 v37.9,30.9
UGROUND  (via drill 0.35)
  Top 0.3: SJ2.1 17.74,31.95 L1.1 20.34,31.27 C6.1 21.6,29.65 v21.6,28.7 | v45.45,18.25 44.95,18.25 43.96,17.26 X2.1 | U$2.UGND 55.36,26.28 v55.98,26.9
  Bottom 0.3: v55.98,26.9 56.09,27.01 58.5,24.6 58.5,20.2 56,17.7 46,17.7 v45.45,18.25 44.35,18.25 39.4,23.2 32.7,23.2 29.88,26.02 26.58,26.02 24.8,27.8 24.5,27.8 22.4,25.7 20.7,27.4 20.7,27.8 v21.6,28.7
USBVCC  (via drill 0.35)
  Top 0.3: Q1.3 33.96,8.36 34.4,8.8 34.4,17.43 | 34.4,17.43 F1.1 | U$2.UVCC 53.81,25.09 53.81,26.22 53.33,26.7 52.7,26.7 52,26 52,25.3 v36.4,25.3 36.3,25.2 | v33.4,24 32,22.6 32,19.83 34.4,17.43
  Bottom 0.3: v36.4,25.3 35,23.9 33.4,23.9 v33.4,24
VCC  (via drill 0.35)  (2 unrouted)
  Top 0.3: JP5.2 36.98,63.41 U$1.20 48.69,63.41 50,62.1 v50,59.7 | v28.9,67.6 28.61,67.6 27.4,68.81 | 27.4,68.81 D2.C | D3.C 24.37,70.33 25.89,68.81 27.4,68.81 | IC1.3 5.25,34.88 C11.+ 4.88,32.73 C13.1 | C13.1 6.59,31.9 RN4D..2 | C13.1 4.05,30.41 3.8,30.16 3.8,27.57 IC3.4 4.81,26.8 v7.4,26.8 | 10.53,26.68 10.56,26.65 | 10.56,26.65 C15.2 12.82,24.39 R6.2 14.68,24 v16.7,24 | RN4C..2 5.5,17.15 | 5.5,17.15 5.15,17.15 4.8,17.5 4.8,20.37 IC3.2 | v9.85,26.65 10.56,26.65 | C1.1 10.04,18.24 8.1,16.3 5.4,16.3 5.4,17.05 5.5,17.15 | RN2B..2 35.6,34.76 | 35.6,34.76 36.58,34.76 RN1C..2 36.62,33.88 39,31.5 39.46,31.5 RN2C..2 41.25,31.62 42.46,32.84 | 42.46,32.84 43.81,34.19 | 43.81,34.19 C7.2 | Q1.2 32.7,11.65 32.7,14.74 RN1A.2 32.27,16.84 29.9,19.2 29,19.2 28.9,19.3 v28.9,24.1 31.8,24.1 v32.5,24.8 | U$1.7 48.5,51.9 48.5,39.2 | 48.5,39.2 48.5,39.1 | 43.81,34.19 41.2,36.8 41.2,37.4 v41.3,37.4 | v48.2,38.9 48.5,39.2 | U$2.VCC 51.59,22.89 v51.2,22.5 | v43.85,32.34 43.35,32.84 42.46,32.84 | 35.6,34.76 35.6,35.5 34.7,36.4 30.8,36.4 30.8,33.1 31.2,32.7 35.2,32.7 36.4,31.5 36.4,28.7 v35.8,28.1 | JP7.2 50.36,9.66 49.69,8.99 47.77,8.99 46.41,10.35 46.41,12.27 47.77,13.63 49.23,13.63 50.57,14.97 50.57,15.18 53.13,17.75 55.19,17.75 55.9,18.46 v55.9,18.9 | U$2.AVCC 53.05,25.35 v53.05,26.02
  Top 0.5: 4.5,34.13 C11.+
  Bottom 0.3: JP5.2 31.64,66.26 30.4,67.5 28.9,67.5 v28.9,67.6 | JP4.4 66.18,48.53 66.18,53.93 60.08,60.03 56.63,60.03 U$1.7 53.5,56.9 51,56.9 50,57.9 v50,59.7 | v7.4,26.8 9.8,26.8 9.9,26.7 v9.85,26.65 | v41.3,37.4 42.8,38.9 v48.2,38.9 | 50.42,26.02 51,25.44 51,22.7 v51.2,22.5 51.2,20.8 53.1,18.9 v55.9,18.9 | 50.42,26.02 48.8,27.64 48.8,28.6 49.6,29.4 49.6,31.6 48.7,32.5 44,32.5 v43.85,32.35 v43.85,32.34 | v53.05,26.02 50.42,26.02 | v28.9,24.1 26.4,24.1 25.3,25.2 24.2,25.2 23,24 v16.7,24 | v35.8,28.1 v32.5,24.8
XT1  (via drill 0.35)
  Top 0.3: Q2.3 17.01,35.99 18.1,34.9 18.89,34.9 | 18.89,34.9 R12.2 | C16.1 22.16,27.96 24.8,30.6 | 24.8,30.6 24.8,32.4 22.3,34.9 18.89,34.9 | U$2.XTAL2 34.71,23.89 30.8,27.8 v29.8,27.8 | v24.82,29.86 24.8,29.88 24.8,30.6
  Bottom 0.3: v29.8,27.8 27,27.8 24.8,30 24.8,29.88 v24.82,29.86
XT2  (via drill 0.35)
  Top 0.3: C8.1 17.56,66.7 21.2,66.7 v21.2,66.78 | v24,41.8 23.8,41.8 23.25,41.25 23.3,41.2 | 23.3,41.2 22,39.9 21.52,39.9 Q2.1 | R12.1 21.81,35.72 22.55,36.45 | 22.55,36.45 23.8,37.7 23.8,40.7 23.3,41.2 | U$2.XTAL1 52.51,24.59 34.91,24.59 34.91,24.57 30.79,28.69 v30.19,28.69 | v23.3,35.1 22.55,35.85 22.55,36.45
  Top 0.5: 21,40.42 Q2.1
  Bottom 0.3: v21.2,66.78 21.2,65.88 23.6,63.48 23.6,42.2 v24,41.8 | v23.3,35.1 23.2,35.1 23.1,35 23.1,31 23.5,30.6 25.14,30.6 27.06,28.68 v30.18,28.68 v30.19,28.69
XTAL2  (via drill 0.35)
  Top 0.3: XTAL2.4 67.17,31.73 66.4,32.5 | 66.4,32.5 R13.2 63.34,32.56 62.5,33.4 v62.55,33.45 | 66.4,32.5 63.56,29.66 C14.2
  Bottom 0.3: v62.55,33.45 64.6,35.5 64.6,53 58.5,59.1 56.91,59.1 53.76,55.95 50.61,55.95 49.02,57.54 49.02,60.68 52.2,60.68 U$1.9
XUSB
  Top 0.3: X2.4 42.74,12.8 38.68,12.8 35.81,15.66 F1.2